# EasyEDA Pro project Capacitive-Fluid-Level-Sensor-schematic.epro

# Schematic Schematic1
Create Date: 2024-04-21; Page Name: P1; Project Name: rust_examples_2024-04-20_22-08-51; Schematic Name: Schematic1; Update Date: 2024-04-20; Company: EasyEDA.com; Drawn: EasyEDA; Page Size: A4; Part Number: JLCPCB-002; Reviewed: EasyEDA; Version: V0.1
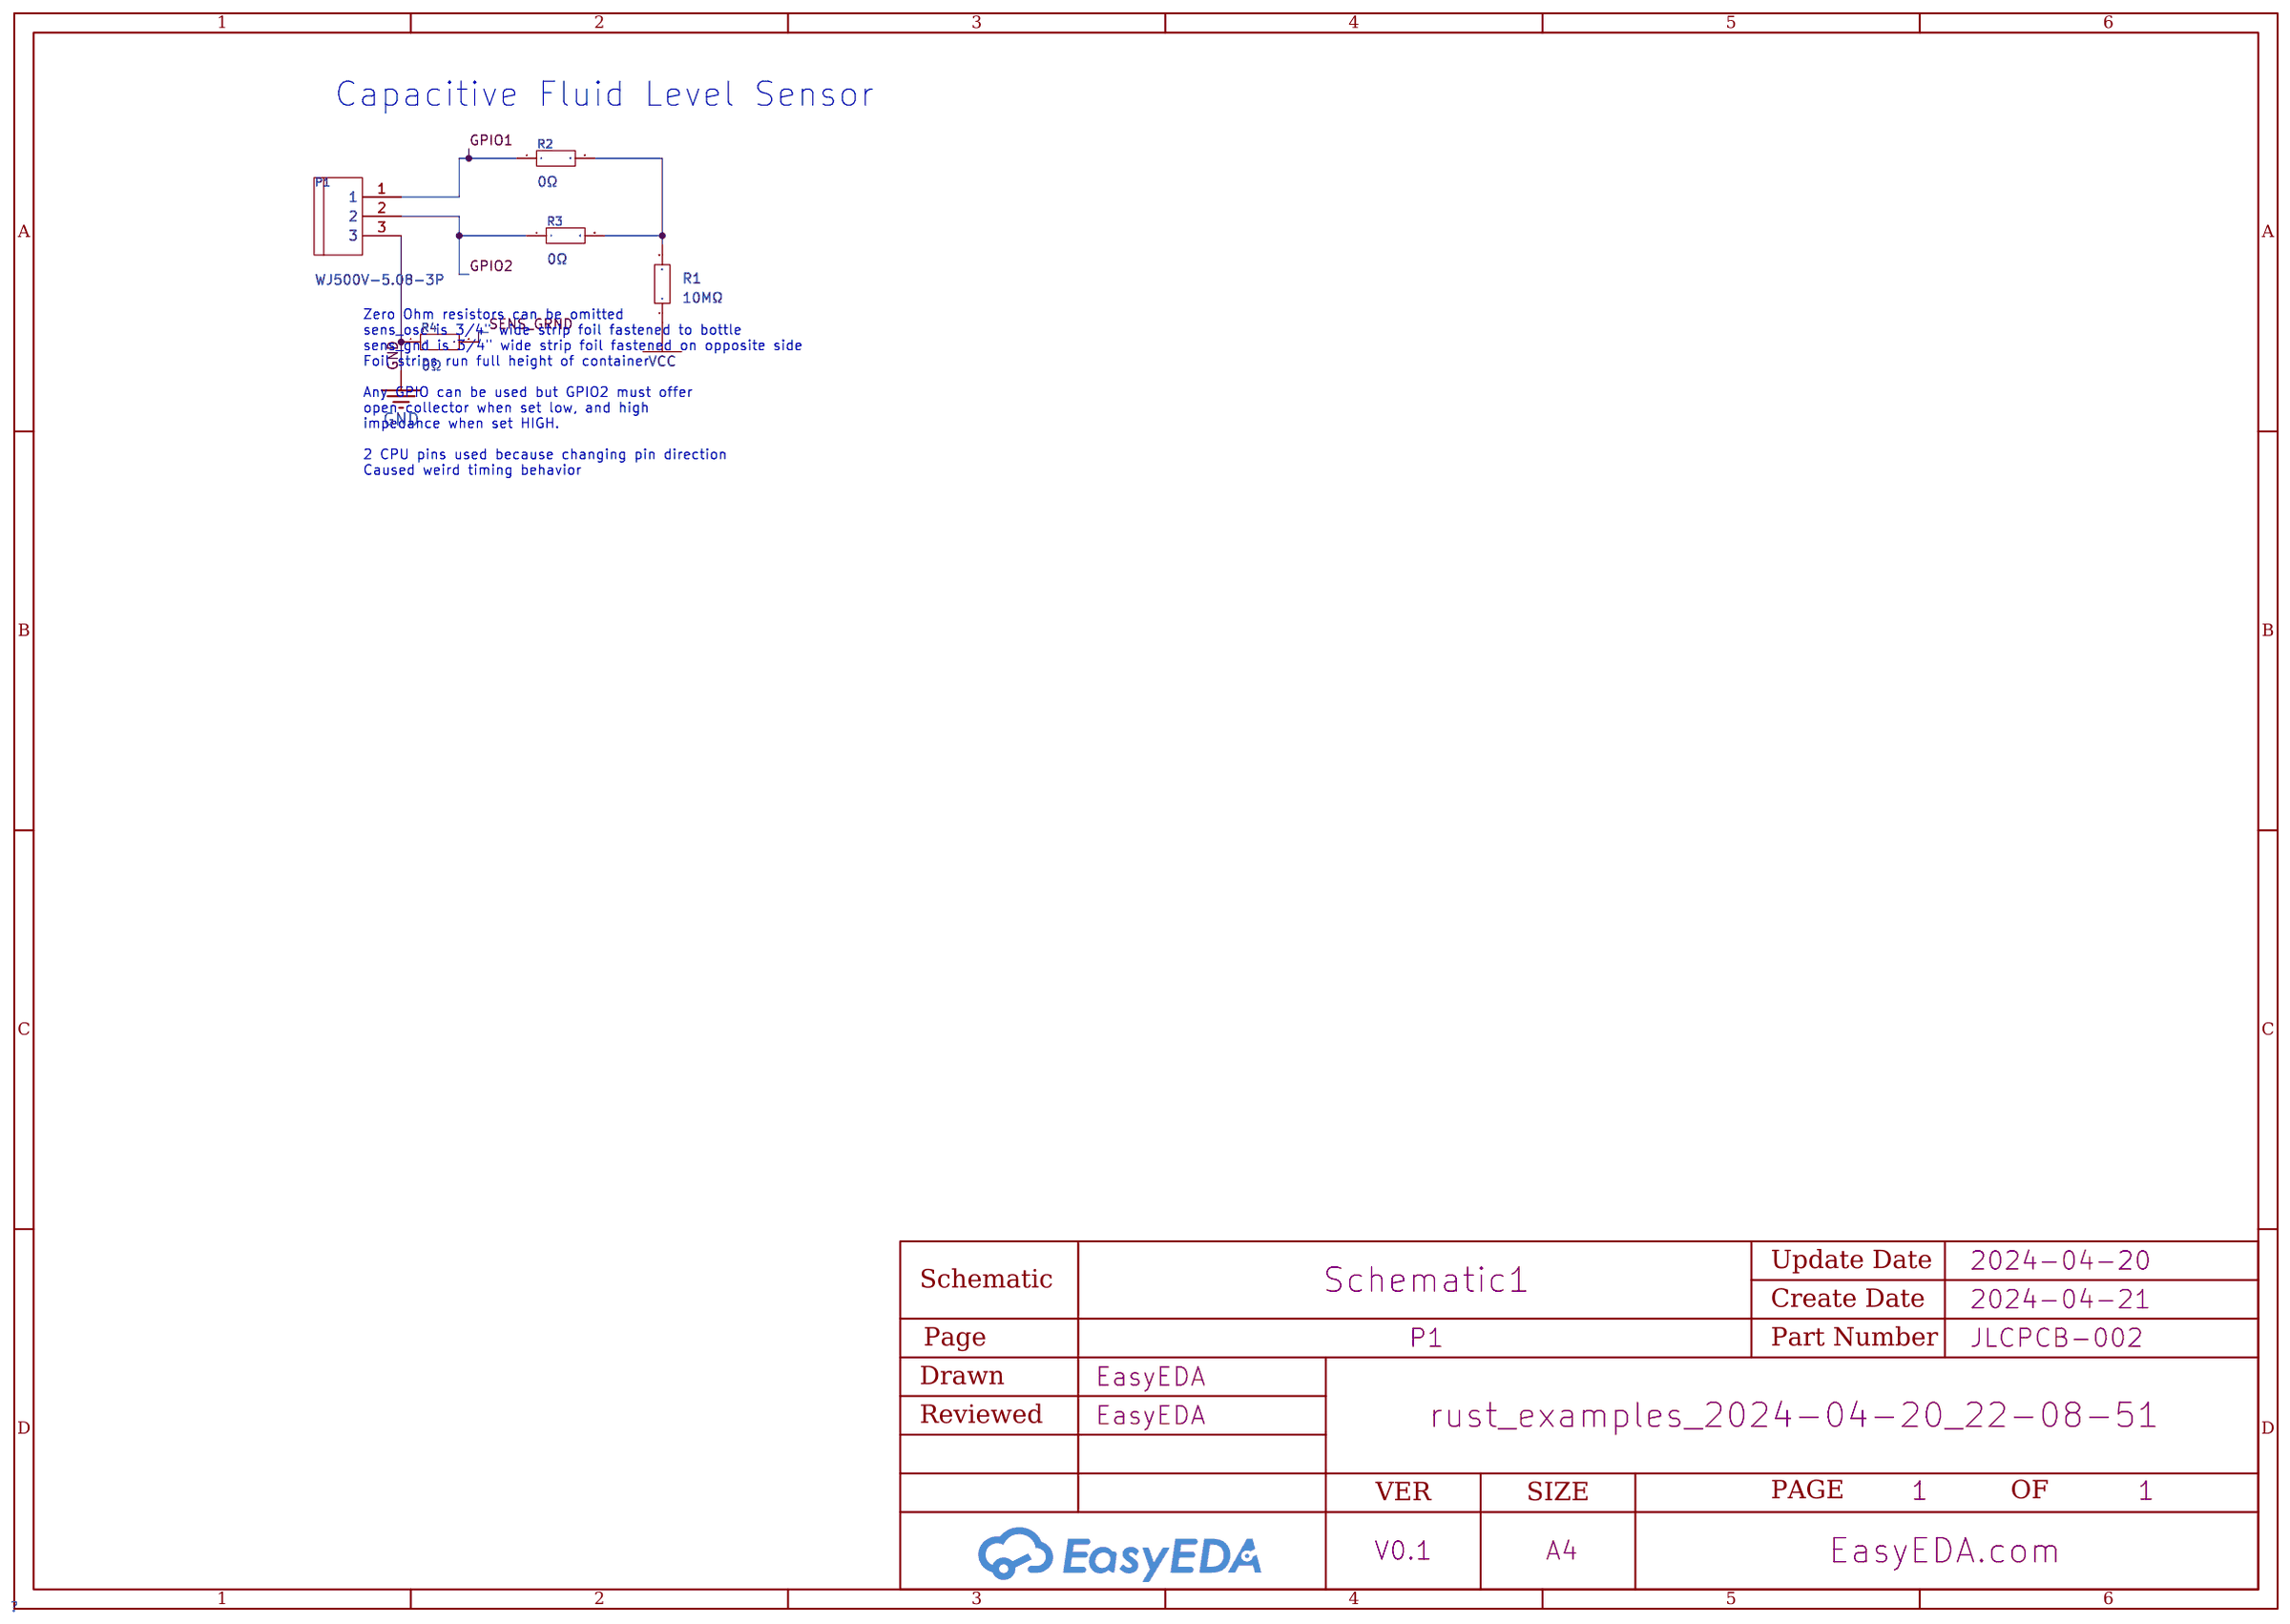
[diagram p0: schematic sheet]

## Parts
P1  WJ500V-5.08-3P  [CONN-TH_3P-P5.00_WJ500V-5.08-3P]
R1  10MΩ  [R0805]
R2  0Ω  [R0805]
R3  0Ω  [R0805]
R4  0Ω  [R0805]

## Library data of the parts
P1 = WJ500V-5.08-3P: Structure:1x3P Pitch:5.08mm Color:Green Mounting Style:Straight Current Rating (Max):18A Voltage Rating (Max):250V Number of Pins:3P Number of Rows:1 Wire Gauge - AWG:14~30 Wire Gauge - AWG:14~30 Wire Gauge - mm2:2.5 Wire Gauge - mm2:2.5 Number of PINs Pe; LCSC Part Name: 5.08mm 1x3P 排数:1 每排P数:3 直插; Supplier Part: C72334; Manufacturer: KANGNEX(康奈克斯电气); Supplier Footprint: 插件,P=5.08mm; Datasheet: https://atta.szlcsc.com/upload/public/pdf/source/20191225/C72334_8A5EF831D67650233B6B1E3F2BC06274.pdf; Supplier: LCSC; Structure: 1x3P; Pitch: 5.08mm; Color: Green; Mounting Style: Straight; Current Rating (Max): 18A; Voltage Rating (Max): 250V; Number of Pins: 3P; Number of Rows: 1; Wire Gauge - AWG: 14~30; Wire Gauge - mm2: 2.5; Number of PINs Per Row: 3; Operating Temperature Range: -40℃~+105℃
R1 = 0805W8F1005T5E: Type:Thick Film Resistors Resistance:10MΩ Tolerance:±1% Tolerance:±1% Power(Watts): Overload Voltage (Max): Temperature Coefficient:±100ppm/℃ Temperature Coefficient:±100ppm/℃ Operating Temperature Range:-55℃~+155℃ Operating Temperature Range:-55℃~+155℃; LCSC Part Name: 10MΩ ±1% 125mW 厚膜电阻; Supplier Part: C26108; Manufacturer: UNI-ROYAL(厚声); Supplier Footprint: 0805; JLCPCB Part Class: Extended Part; Datasheet: https://atta.szlcsc.com/upload/public/pdf/source/20200306/C422600_1E6D84923E4A46A82E41ADD87F860B5C.pdf; Supplier: LCSC; Type: Thick Film Resistors; Tolerance: ±1%; Temperature Coefficient: ±100ppm/℃; Operating Temperature Range: -55℃~+155℃
R2-R4 = 0805W8F0000T5E_C17477: Type:Thick Film Resistors Resistance: Tolerance:±1% Tolerance:±1% Power(Watts): Overload Voltage (Max): Temperature Coefficient:±800ppm/℃ Temperature Coefficient:±800ppm/℃ Operating Temperature Range:-55℃~+155℃ Operating Temperature Range:-55℃~+155℃; LCSC Part Name: 0Ω ±1% 125mW 厚膜电阻; Supplier Part: C17477; Manufacturer: UNI-ROYAL(厚声); Manufacturer Part: 0805W8F0000T5E; Supplier Footprint: 0805; Datasheet: https://atta.szlcsc.com/upload/public/pdf/source/20200306/C422600_1E6D84923E4A46A82E41ADD87F860B5C.pdf; Supplier: LCSC; Type: Thick Film Resistors; Tolerance: ±1%; Temperature Coefficient: ±800ppm/℃; Operating Temperature Range: -55℃~+155℃

## Nets
GND: P1.3 R4.1
VCC: R1.1
GPIO1: P1.1 R2.1
GPIO2: P1.2 R3.1
SENS_GRND: R4.2
Net-(R1-2): R1.2 R2.2 R3.2

## Notes on the sheet
- Capacitive Fluid Level Sensor
- Zero Ohm resistors can be omitted
  sens_osc is 3/4" wide strip foil fastened to bottle
  sens_gnd is 3/4" wide strip foil fastened on opposite side
  Foil strips run full height of container
  Any GPIO can be used but GPIO2 must offer
  open collector when set low, and high
  impedance when set HIGH.
  2 CPU pins used because changing pin direction
  Caused weird timing behavior
